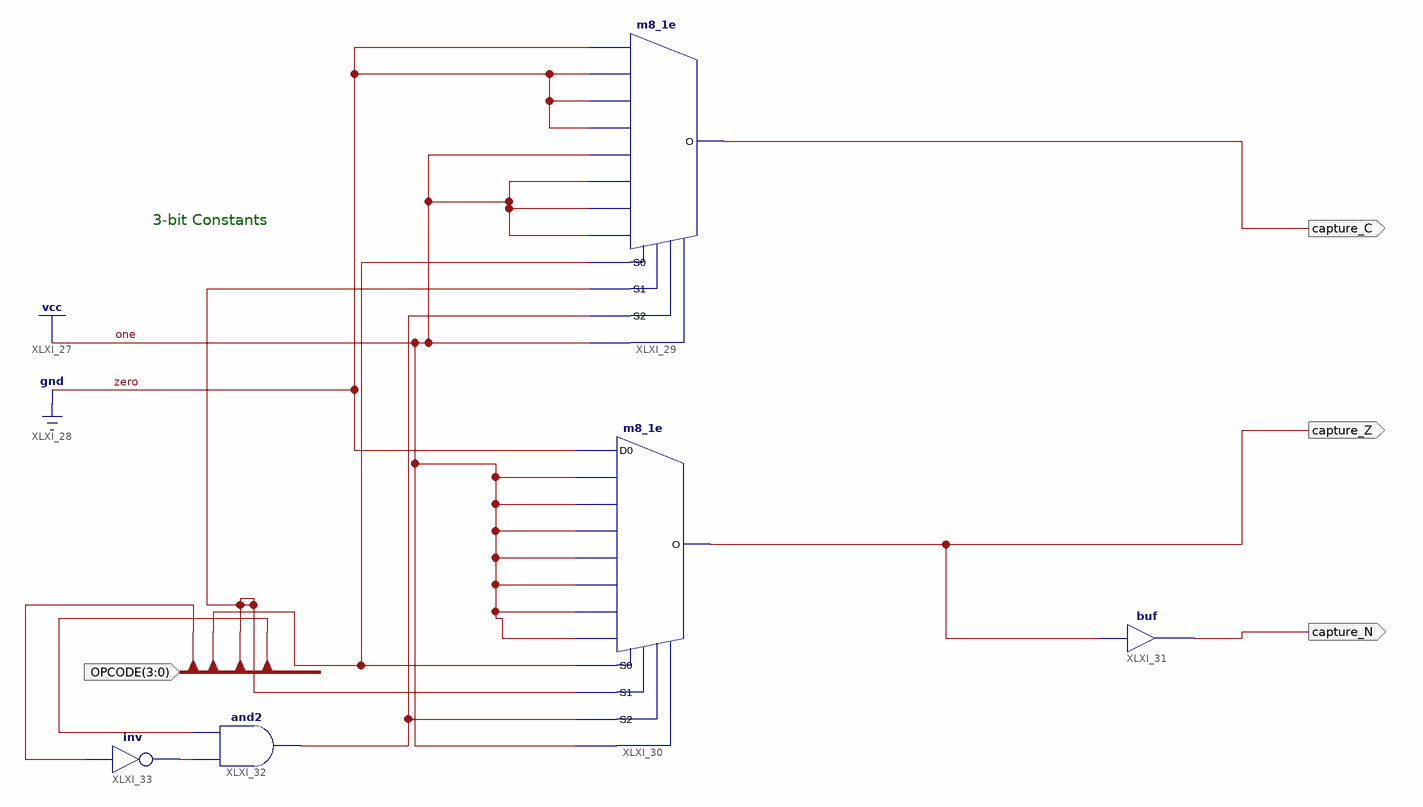
[diagram p0: schematic sheet 1]
// Xilinx ISE schematic Instruction_Decoder.sch (spartan6) as structural Verilog: 5 symbols, 4 ports
module Instruction_Decoder (
  input  [3:0] OPCODE,
  output capture_C,
  output capture_Z,
  output capture_N
);

  wire XLXN_1, XLXN_7;

  m8_1e XLXI_29 (
    .D0(1'b0), .D1(1'b0), .D2(1'b0), .D3(1'b0), .D4(1'b1), .D5(1'b1), .D6(1'b1), .D7(1'b1), .E(1'b1),
    .S0(OPCODE[0]), .S1(OPCODE[1]), .S2(XLXN_7), .O(capture_C));
  m8_1e XLXI_30 (
    .D0(1'b0), .D1(1'b1), .D2(1'b1), .D3(1'b1), .D4(1'b1), .D5(1'b1), .D6(1'b1), .D7(1'b1), .E(1'b1),
    .S0(OPCODE[0]), .S1(OPCODE[1]), .S2(XLXN_7), .O(capture_Z));
  buf XLXI_31 (capture_N, capture_Z);
  and XLXI_32 (XLXN_7, XLXN_1, OPCODE[2]);
  not XLXI_33 (XLXN_1, OPCODE[3]);

  // Notes on the sheet:
  //   3-bit Constants
endmodule
